# Altium schematic sheet ControlBoard mk2.SchDoc
size A4
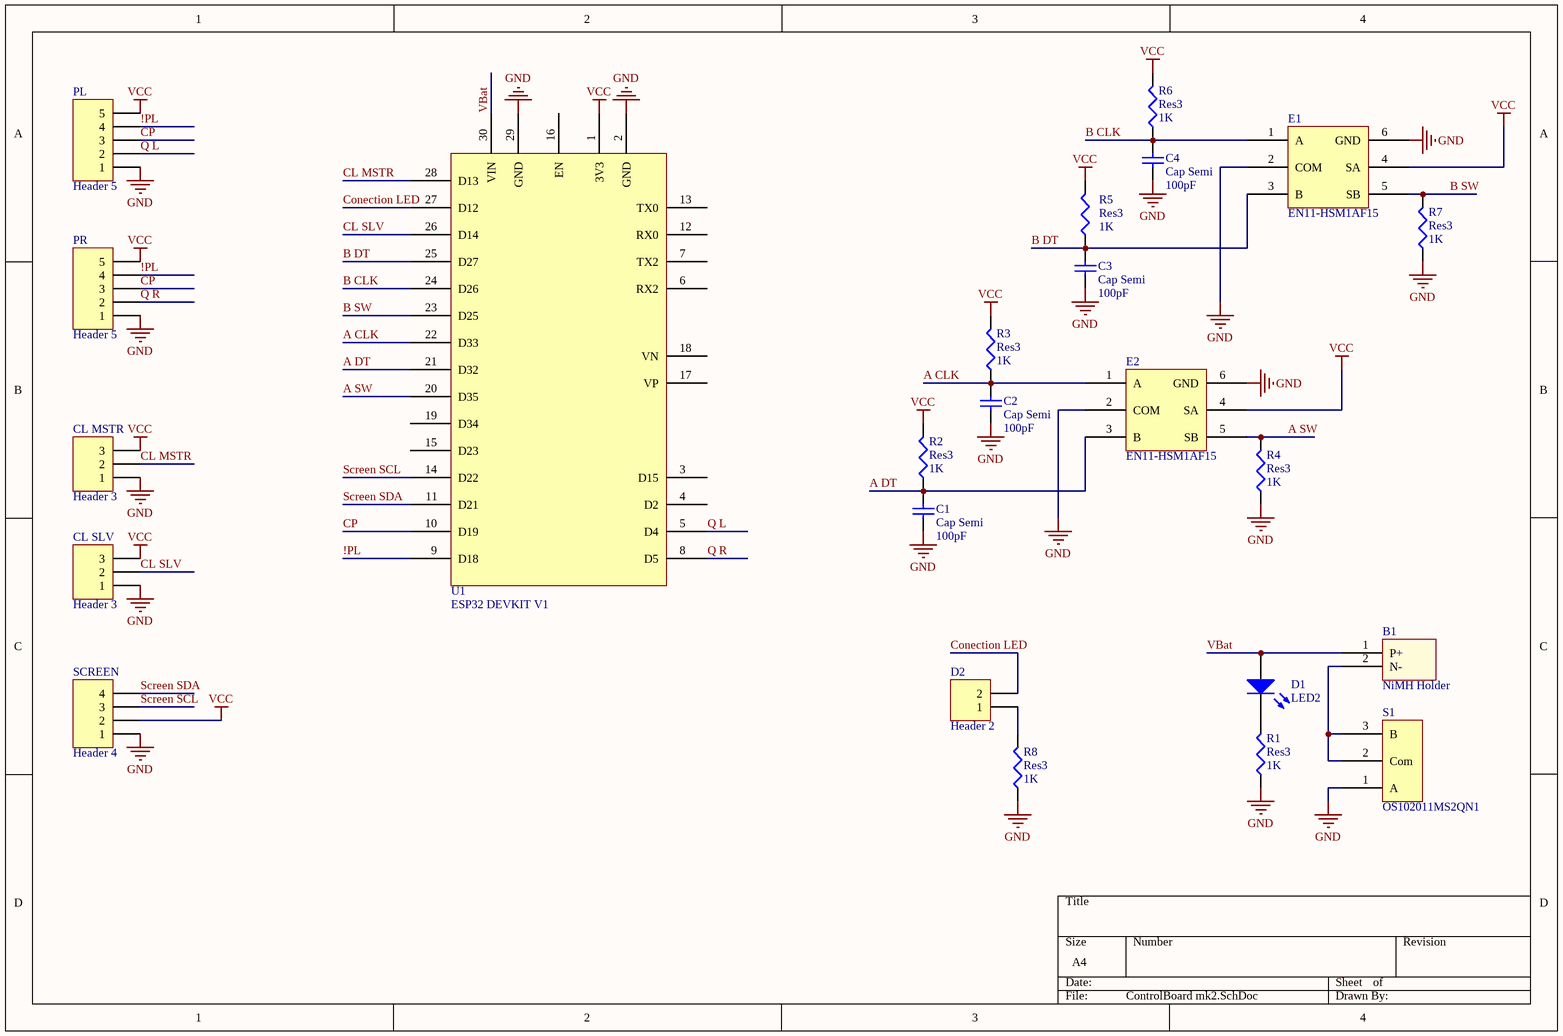
[diagram p0: ControlBoard mk2.SchDoc]

## Parts
B1  NiMH Holder  [NiMH Holder]
C1  Cap Semi  value 100pF  [0603 Cap Long Boi]
C2  Cap Semi  value 100pF  [0603 Cap Long Boi]
C3  Cap Semi  value 100pF  [0603 Cap Long Boi]
C4  Cap Semi  value 100pF  [0603 Cap Long Boi]
CL_MSTR  Header 3  [3 Pin Side Mount]
CL_SLV  Header 3  [3 Pin Side Mount]
D1  LED2  [LTST-C171TBKT]
D2  Header 2  [HDR1X2]
E1  EN11-HSM1AF15  [EN11-HSM1AF15]
E2  EN11-HSM1AF15  [EN11-HSM1AF15]
PL  Header 5  [5 Pin Side Mount]
PR  Header 5  [HDR1X5]
R1  Res3  value 1K  [0603 Res Long Boi - duplicate]
R2  Res3  value 1K  [0603 Res Long Boi - duplicate]
R3  Res3  value 1K  [0603 Res Long Boi - duplicate]
R4  Res3  value 1K  [0603 Res Long Boi - duplicate]
R5  Res3  value 1K  [0603 Res Long Boi - duplicate]
R6  Res3  value 1K  [0603 Res Long Boi - duplicate]
R7  Res3  value 1K  [0603 Res Long Boi - duplicate]
R8  Res3  value 1K  [0603 Res Long Boi - duplicate]
S1  OS102011MS2QN1  [OS102011MS2QN1]
SCREEN  Header 4  [4 Pin Side Mount]
U1  ESP32 DEVKIT V1  [ESP32 DEVKIT V1]

## Nets
GND: C1.2 C2.1 C3.2 C4.1 CL_MSTR.1 CL_SLV.1 E1.2(COM) E1.6(GND) E2.2(COM) E2.6(GND) PL.1 PR.1 R1.1 R4.1 R7.1 R8.1 S1.1(A) SCREEN.1 U1.2(GND) U1.29(GND)
VCC: CL_MSTR.3 CL_SLV.3 E1.4(SA) E2.4(SA) PL.5 PR.5 R2.2 R3.2 R5.2 R6.2 SCREEN.2 U1.1(3V3)
!PL: PL.4 PR.4 U1.9(D18)
A CLK: C2.2 E2.1(A) R3.1 U1.22(D33)
A DT: C1.1 E2.3(B) R2.1 U1.21(D32)
A SW: E2.5(SB) R4.2 U1.20(D35)
B CLK: C4.2 E1.1(A) R6.1 U1.24(D26)
B DT: C3.1 E1.3(B) R5.1 U1.25(D27)
B SW: E1.5(SB) R7.2 U1.23(D25)
CL MSTR: CL_MSTR.2 U1.28(D13)
CL SLV: CL_SLV.2 U1.26(D14)
Conection LED: D2.2 U1.27(D12)
CP: PL.3 PR.3 U1.10(D19)
Q L: PL.2 U1.5(D4)
Q R: PR.2 U1.8(D5)
Screen SCL: SCREEN.3 U1.14(D22)
Screen SDA: SCREEN.4 U1.11(D21)
VBat: B1.1(P+) D1.1(A) U1.30(VIN)
NetB1_2: B1.2(N-) S1.2(Com) S1.3(B)
NetD1_2: D1.2(K) R1.2
NetD2_1: D2.1 R8.2

Not connected (* = marked no-connect by the designer): U1 3(D15) 4(D2) 6(RX2) 7(TX2) 12(RX0) 13(TX0) 15(D23) 16(EN) 17(VP) 18(VN) 19(D34)

## Library data of the parts
C1-C4 = Cap Semi: Capacitor (Semiconductor SIM Model); Published: 8-Jun-2000; LatestRevisionDate: 29-May-2009; LatestRevisionNote: IPC-7351 Footprint Added.; PackageReference: C1206; Publisher: Altium Limited; PackageDescription: Chip Capacitor
CL_MSTR CL_SLV = Header 3: Header, 3-Pin; LatestRevisionDate: 17-Jul-2002; LatestRevisionNote: Re-released for DXP Platform.; Publisher: Altium Limited
D1 = LED2: Typical RED, GREEN, YELLOW, AMBER GaAs LED; Published: 8-Jun-2000; LatestRevisionDate: 17-Jul-2002; LatestRevisionNote: Re-released for DXP Platform.; PackageVersion: Feb-2002; PackageReference: 3.2X1.6X1.1; Publisher: Altium Limited; PackageDescription: SM LED; 2 Flat Leads
D2 = Header 2: Header, 2-Pin; LatestRevisionDate: 17-Jul-2002; LatestRevisionNote: Re-released for DXP Platform.; Publisher: Altium Limited
PL PR = Header 5: Header, 5-Pin; LatestRevisionDate: 17-Jul-2002; LatestRevisionNote: Re-released for DXP Platform.; Publisher: Altium Limited
R1-R8 = Res3: Resistor; Published: 8-Jun-2000; LatestRevisionDate: 29-May-2009; LatestRevisionNote: IPC-7351 Footprint Added.; PackageReference: J1-0603; Publisher: Altium Limited; PackageDescription: Chip Resistor
SCREEN = Header 4: Header, 4-Pin; LatestRevisionDate: 17-Jul-2002; LatestRevisionNote: Re-released for DXP Platform.; Publisher: Altium Limited